# Altium schematic sheet PAGE1.SchDoc
size 386 x 246 mm
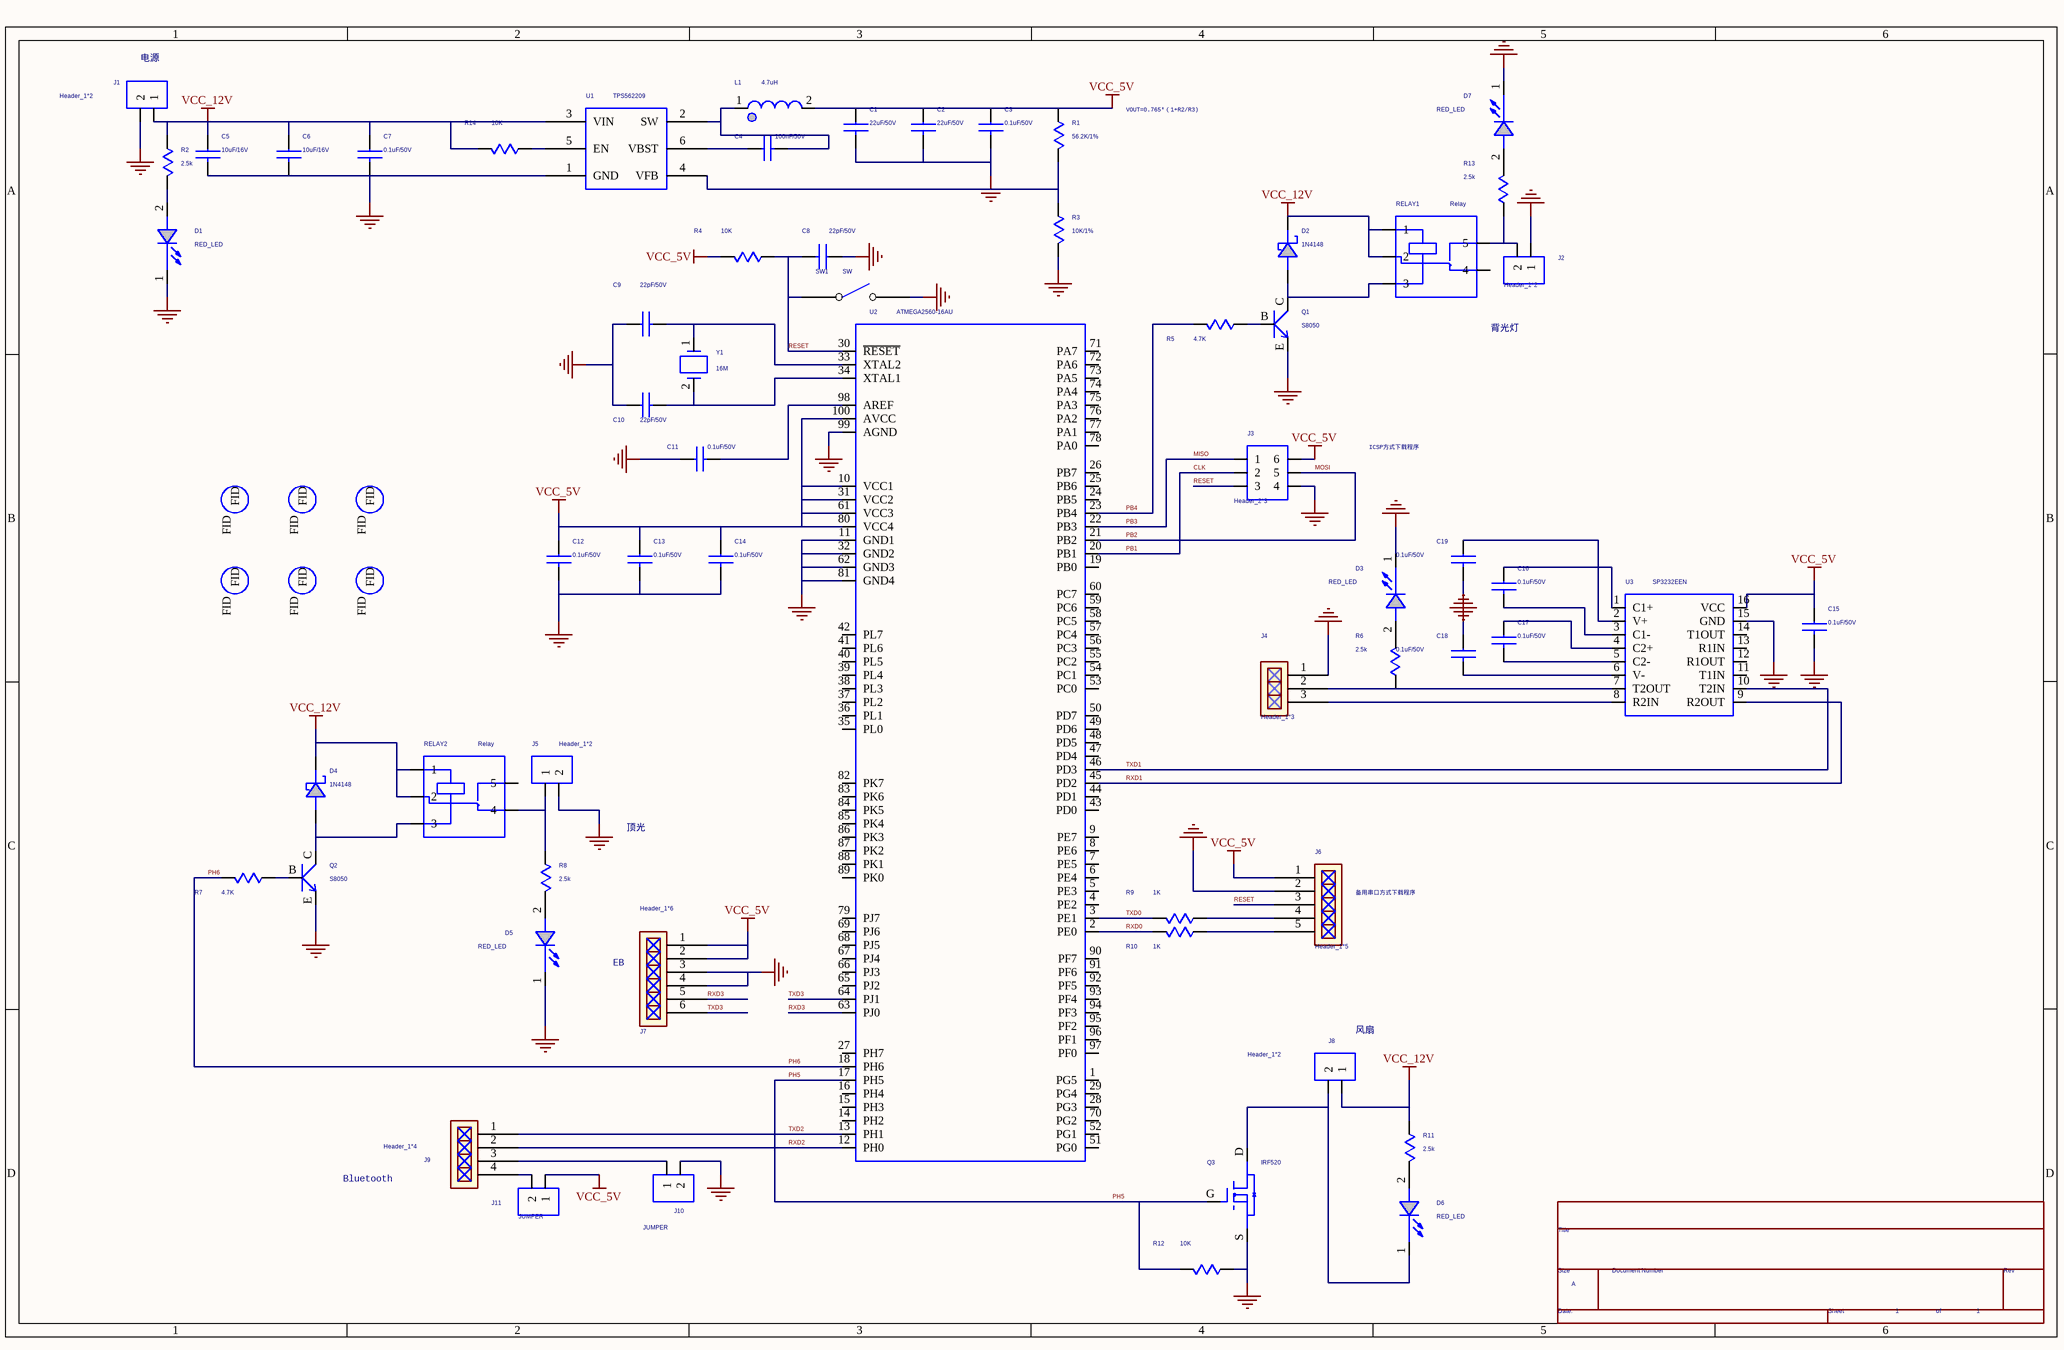
[diagram p0: PAGE1.SchDoc]

## Parts
*  Page Size: A  Page Number: 1  (hidden comment: TitleBlock0)  (graphical)
C1  22uF/50V  [c1206]
C2  22uF/50V  [c1206]
C3  0.1uF/50V  [c0603]
C4  100nF/50V  [c0603]
C5  10uF/16V  [c0805]
C6  10uF/16V  [c0805]
C7  0.1uF/50V  [c0603]
C8  22pF/50V  [c0603]
C9  22pF/50V  [c0603]
C10  22pF/50V  [c0603]
C11  0.1uF/50V  [c0603]
C12  0.1uF/50V  [c0603]
C13  0.1uF/50V  [c0603]
C14  0.1uF/50V  [c0603]
C15  0.1uF/50V  [c0603]
C16  0.1uF/50V  [c0603]
C17  0.1uF/50V  [c0603]
C18  0.1uF/50V  [c0603]
C19  0.1uF/50V  [c0603]
D1  RED_LED  [D0603]
D2  1N4148  [D1206]
D3  RED_LED  [D0603]
D4  1N4148  [D1206]
D5  RED_LED  [D0603]
D6  RED_LED  [D0603]
D7  RED_LED  [D0603]
FID1  FID  [SMD_1MM]  (value not drawn)
FID2  FID  [SMD_1MM]  (value not drawn)
FID3  FID  [SMD_1MM]  (value not drawn)
FID4  FID  [SMD_1MM]  (value not drawn)
FID5  FID  [SMD_1MM]  (value not drawn)
FID6  FID  [SMD_1MM]  (value not drawn)
J1  Header_1*2  [SIP2_2P54]
J2  Header_1*2  [SIP2_2P54]
J3  Header_2*3  [SIP2X3_2P54]
J4  Header_1*3  [KF2EDG3_81mm3P]
J5  Header_1*2  [SIP2_2P54]
J6  Header_1*5  [SIP1X5_2P54]
J7  Header_1*6  [SIP1X6_2P54]
J8  Header_1*2  [SIP2_2P54]
J9  Header_1*4  [SIP1X4_2P54]
J10  JUMPER  [SIP2_2P54]
J11  JUMPER  [SIP2_2P54]
L1  4.7uH  [L5X5X2]
Q1  S8050  [SOT-23]
Q2  S8050  [SOT-23]
Q3  IRF520  [TO-220AB]
R1  56.2K/1%  [R0603]
R2  2.5k  [R0603]
R3  10K/1%  [R0603]
R4  10K  [R0603]
R5  4.7K  [R0603]
R6  2.5k  [R0603]
R7  4.7K  [R0603]
R8  2.5k  [R0603]
R9  1K  [R0603]
R10  1K  [R0603]
R11  2.5k  [R0603]
R12  10K  [R0603]
R13  2.5k  [R0603]
R14  10K  [R0603]
RELAY1  Relay  [Relay]
RELAY2  Relay  [Relay]
SW1  SW  [sw2-0306]
U1  TPS562209  [SOT-6]
U2  ATMEGA2560-16AU  [TQFP-100]
U3  SP3232EEN  [SOIC-16]
Y1  16M  [HC-49SMD]

## Nets
GND: C1.2 C2.2 C3.2 C5.2 C6.2 C7.2 C8.1 C9.1 C10.1 C11.1 C12.2 C13.2 C14.2 C15.2 C18.1 C19.2 D1.1(CATHODE) D3.1(CATHODE) D5.1(CATHODE) D7.1(CATHODE) J1.2 J2.1 J3.4 J4.1 J5.2 J6.2 J7.3 J7.4 J10.2 Q1.E Q2.E Q3.S R3.2 R12.1 SW1.2 U1.1(GND) U2.11(GND1) U2.32(GND2) U2.62(GND3) U2.81(GND4) U2.99(AGND) U3.15(GND)
VCC_5V: C1.1 C2.1 C3.1 C12.1 C13.1 C14.1 C15.1 J3.6 J6.1 J7.1 J7.2 J11.1 L1.2 R1.1 R4.2 U2.10(VCC1) U2.31(VCC2) U2.61(VCC3) U2.80(VCC4) U2.100(AVCC) U3.16(VCC)
VCC_12V: C5.1 C6.1 C7.1 D2.2(CATHODE) D4.2(CATHODE) J1.1 J8.1 R2.1 R11.1 R14.2 RELAY1.1 RELAY1.2 RELAY2.1 RELAY2.2 U1.3(VIN)
CLK: J3.2 U2.20(PB1)  [also labelled PB1]
MISO: J3.1 U2.22(PB3)  [also labelled PB3]
MOSI: J3.5 U2.21(PB2)  [also labelled PB2]
PB4: R5.2 U2.23(PB4)
PH5: Q3.G R12.2 U2.17(PH5)
PH6: R7.2 U2.18(PH6)
RESET: C8.2 J3.3 J6.3 R4.1 SW1.1 U2.30(~{RESET})
RXD0: R10.2 U2.2(PE0)
RXD1: U2.45(PD2) U3.9(R2OUT)
RXD2: J9.2 U2.12(PH0)
RXD3: J7.5 U2.63(PJ0)
TXD0: R9.2 U2.3(PE1)
TXD1: U2.46(PD3) U3.10(T2IN)
TXD2: J9.1 U2.13(PH1)
TXD3: J7.6 U2.64(PJ1)
NetC4_1: C4.1 U1.6(VBST)
NetC4_2: C4.2 L1.1 U1.2(SW)
NetC9_2: C9.2 U2.33(XTAL2) Y1.1
NetC10_2: C10.2 U2.34(XTAL1) Y1.2
NetC11_2: C11.2 U2.98(AREF)
NetC16_1: C16.1 U3.1(C1+)
NetC16_2: C16.2 U3.3(C1-)
NetC17_1: C17.1 U3.4(C2+)
NetC17_2: C17.2 U3.5(C2-)
NetC18_2: C18.2 U3.6(V-)
NetC19_1: C19.1 U3.2(V+)
NetD1_2: D1.2(ANODE) R2.2
NetD2_1: D2.1(ANODE) Q1.C RELAY1.3
NetD3_2: D3.2(ANODE) R6.2
NetD4_1: D4.1(ANODE) Q2.C RELAY2.3
NetD5_2: D5.2(ANODE) R8.2
NetD6_1: D6.1(CATHODE) J8.2 Q3.D
NetD6_2: D6.2(ANODE) R11.2
NetD7_2: D7.2(ANODE) R13.2
NetJ2_2: J2.2 R13.1 RELAY1.5
NetJ4_2: J4.2 R6.1 U3.7(T2OUT)
NetJ4_3: J4.3 U3.8(R2IN)
NetJ5_1: J5.1 R8.1 RELAY2.4
NetJ6_4: J6.4 R9.1
NetJ6_5: J6.5 R10.1
NetJ9_3: J9.3 J10.1
NetJ9_4: J9.4 J11.2
NetQ1_B: Q1.B R5.1
NetQ2_B: Q2.B R7.1
NetR1_2: R1.2 R3.1 U1.4(VFB)
NetR14_1: R14.1 U1.5(EN)

Not connected (* = marked no-connect by the designer): FID1 FID; FID2 FID; FID3 FID; FID4 FID; FID5 FID; FID6 FID; RELAY1 4; RELAY2 5; U2 1(PG5) 4(PE2) 5(PE3) 6(PE4) 7(PE5) 8(PE6) 9(PE7) 14(PH2) 15(PH3) 16(PH4) 19(PB0) 24(PB5) 25(PB6) 26(PB7) 27(PH7) 28(PG3) 29(PG4) 35(PL0) 36(PL1) 37(PL2) 38(PL3) 39(PL4) 40(PL5) 41(PL6) 42(PL7) 43(PD0) 44(PD1) 47(PD4) 48(PD5) 49(PD6) 50(PD7) 51(PG0) 52(PG1) 53(PC0) 54(PC1) 55(PC2) 56(PC3) 57(PC4) 58(PC5) 59(PC6) 60(PC7) 65(PJ2) 66(PJ3) 67(PJ4) 68(PJ5) 69(PJ6) 70(PG2) 71(PA7) 72(PA6) 73(PA5) 74(PA4) 75(PA3) 76(PA2) 77(PA1) 78(PA0) 79(PJ7) 82(PK7) 83(PK6) 84(PK5) 85(PK4) 86(PK3) 87(PK2) 88(PK1) 89(PK0) 90(PF7) 91(PF6) 92(PF5) 93(PF4) 94(PF3) 95(PF2) 96(PF1) 97(PF0); U3 11(T1IN) 12(R1OUT) 13(R1IN) 14(T1OUT)

## Notes on the sheet
- (near J1) 电源
- VOUT=0.765*（1+R2/R3)
- (near RELAY1) 背光灯
- ICSP方式下载程序
- 顶光
- (near J6) 备用串口方式下载程序
- EB
- (near J8) 风扇
- Bluetooth
- (in symbol TitleBlock0) Title; Size; Document Number; Rev; Date:; Sheet; of

## Library data of the parts
C1-C19 = C
D1 D3 D5-D7 = LED_0
D2 D4 = DIODE SCHOTTKY
J1 J2 J5 J8 = JUMPER
L1 = L
R1-R14 = R: OriginalSymbolOrigin: (0,0); Wattage: ?; Tolerance: ?
RELAY1 RELAY2 = srd-12vdc-sl-c
SW1 = SW SPST
U3 = SP3232
Y1 = XTAL2P: XTAL,25MHz,±20ppm,20pF,11.4*4.7,-20 to 70℃,SM49B20P25M000U0F,KUIXI; Part Number: 803000024
* = TitleBlock0: Page Create Date: March  8, 1995; Page Count: 1